# Altium schematic sheet Output_eFuse.SchDoc
size 297 x 209 mm; SheetNumber: 3; SheetTotal: 4
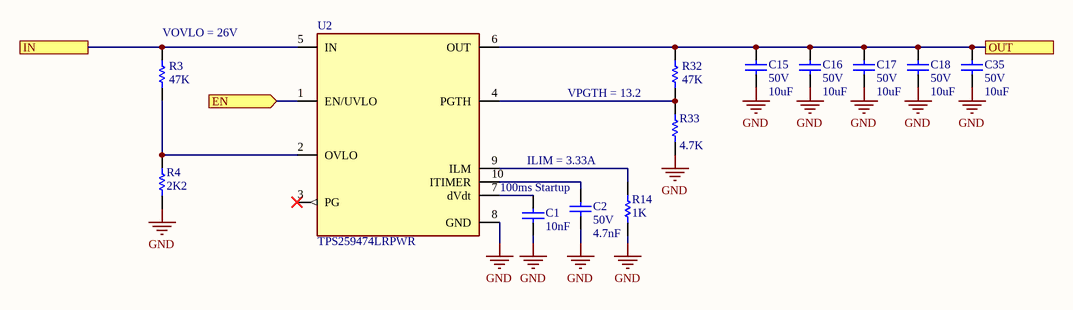
[diagram p0: Output_eFuse.SchDoc]

## Parts
C1  Capacitance: 10nF  [CAPC0805X060]  (hidden comment: CL21B103KBANNNC)
C2  Voltage Rating: 50V  Capacitance: 4.7nF  [CAPC0805X060]  (hidden comment: 0805B472K500NT)
C15  Voltage Rating: 50V  Capacitance: 10uF  [CAPC1210X090]  (hidden comment: CL32B106KBJNNNE)
C16  Voltage Rating: 50V  Capacitance: 10uF  [CAPC1210X090]  (hidden comment: CL32B106KBJNNNE)
C17  Voltage Rating: 50V  Capacitance: 10uF  [CAPC1210X090]  (hidden comment: CL32B106KBJNNNE)
C18  Voltage Rating: 50V  Capacitance: 10uF  [CAPC1210X090]  (hidden comment: CL32B106KBJNNNE)
C35  Voltage Rating: 50V  Capacitance: 10uF  [CAPC1210X090]  (hidden comment: CL32B106KBJNNNE)
R3  Resistance: 47K  [RESC0603]  (hidden comment: 0603WAF4702T5E)
R4  Resistance: 2K2  [RESC0603]  (hidden comment: 0603WAF2201T5E)
R14  Resistance: 1K  [RESC0603]  (hidden comment: 0603WAF1001T5E)
R32  Resistance: 47K  [RESC0603]  (hidden comment: 0603WAF4702T5E)
R33  Resistance: 4.7K  [RESC0603]  (hidden comment: 0603WAF4701T5E)
U2  TPS259474LRPWR  [VFQFN-10]

## Ports
EN (in, see Power_Path[6B]), IN (see Power_Path[5B]), OUT (see Power_Path[6B])

## Nets
GND: C1.1 C2.1 C15.1 C16.1 C17.1 C18.1 C35.1 R4.1 R14.1 R33.1 U2.8(GND)
EN: U2.1(EN/UVLO) ; port EN
IN: R3.2 U2.5(IN) ; port IN
OUT: C15.2 C16.2 C17.2 C18.2 C35.2 R32.2 U2.6(OUT) ; port OUT
NetC1_2: C1.2 U2.7(dVdt)
NetC2_2: C2.2 U2.10(ITIMER)
NetR3_1: R3.1 R4.2 U2.2(OVLO)
NetR14_2: R14.2 U2.9(ILM)
NetR32_1: R32.1 R33.2 U2.4(PGTH)

Not connected (* = marked no-connect by the designer): U2 3(PG)*

## Notes on the sheet
- (near R3) VOVLO = 26V
- VPGTH = 13.2
- 100ms Startup
- ILIM = 3.33A
- Size:
- Title:
- A4
- Project:
- Rev:
- Date:
- Drawn By:
- Sheet:
- of

## Library data of the parts
C1 = CL21B103KBANNNC: 10nF ±10% 50V Ceramic Capacitor X7R 0805 (2012 Metric); Voltage Rating: 25V; Part Number: CL21B103KBANNNC; Distributor Part Number: C1710; Tolerance: 10%; Case Code: 0805; Distributor: JLPCB
C2 = 0805B472K500NT: 4.7nF 50V X7R ±10% 0805 Multilayer Ceramic Capacitors MLCC - SMD/SMT ROHS; Manufacturer: FH; Part Number: 0805B472K500NT; Distributor Part Number: C1744; Tolerance: 10%; Case Code: 0805; Distributor: JLCPCB; Dielectric: X7R
C15-C18 C35 = CL32B106KBJNNNE: 10 µF ±10% 50V Ceramic Capacitor X7R 1210 (3225 Metric); Manufacturer Part Number: CL32B106KBJNNNE; Distributor Part Number: C138687; Tolerance: 10%; Case Code: 1210; Distributor: JLCPCB
R3 R32 = 0603WAF4702T5E: 47kOhms 75V Thick Film Resistor ±1% ±100ppm/℃ 0603 Chip Resistor - Surface Mount ROHS; Manufacturer: UNI-ROYAL; Part Number: 0603WAF4702T5E; Tolerance: 1%; Distributor Part Number: C25819; Distributor: JLCPCB; Case Code: 0603
R4 = 0603WAF2201T5E: 2.2kOhms 75V Thick Film Resistor ±1% ±100ppm/℃ 0603 Chip Resistor - Surface Mount ROHS; Manufacturer: UNI-ROYAL; Part Number: 0603WAF2201T5E; Tolerance: 1%; Distributor Part Number: C4190; Distributor: JLCPCB; Case Code: 0603
R14 = 0603WAF1001T5E: 1 kOhms 75V Thick Film Resistor ±1% ±100ppm/℃ 0603 Chip Resistor - Surface Mount ROHS; Manufacturer: UNI-ROYAL; Part Number: 0603WAF1001T5E; Tolerance: 1%; Distributor Part Number: C21190; Distributor: JLCPCB; Case Code: 0603
R33 = 0603WAF4701T5E: 4.7 kOhms 75V Thick Film Resistor ±1% ±100ppm/℃ 0603 Chip Resistor - Surface Mount ROHS; Manufacturer: UNI-ROYAL; Part Number: 0603WAF4701T5E; Tolerance: 1%; Distributor Part Number: C23162; Distributor: JLCPCB; Case Code: 0603
U2 = TPS259474LRPWR: eFuse 5.5A, 2.7V~23V, 28mOhm, Reverse Current Blocking with Input Reverse Polarity Protection; Part Number: TPS259474LRPWR; Distributor: JLCPCB; Distributor Part Number: C2864845; Operating Temperature: -40°C ~ 125°C; Output Current: 5.5A; Voltage Input: 2.7V~23V